# EAGLE design bb-8 (EAGLE 9.6.2)
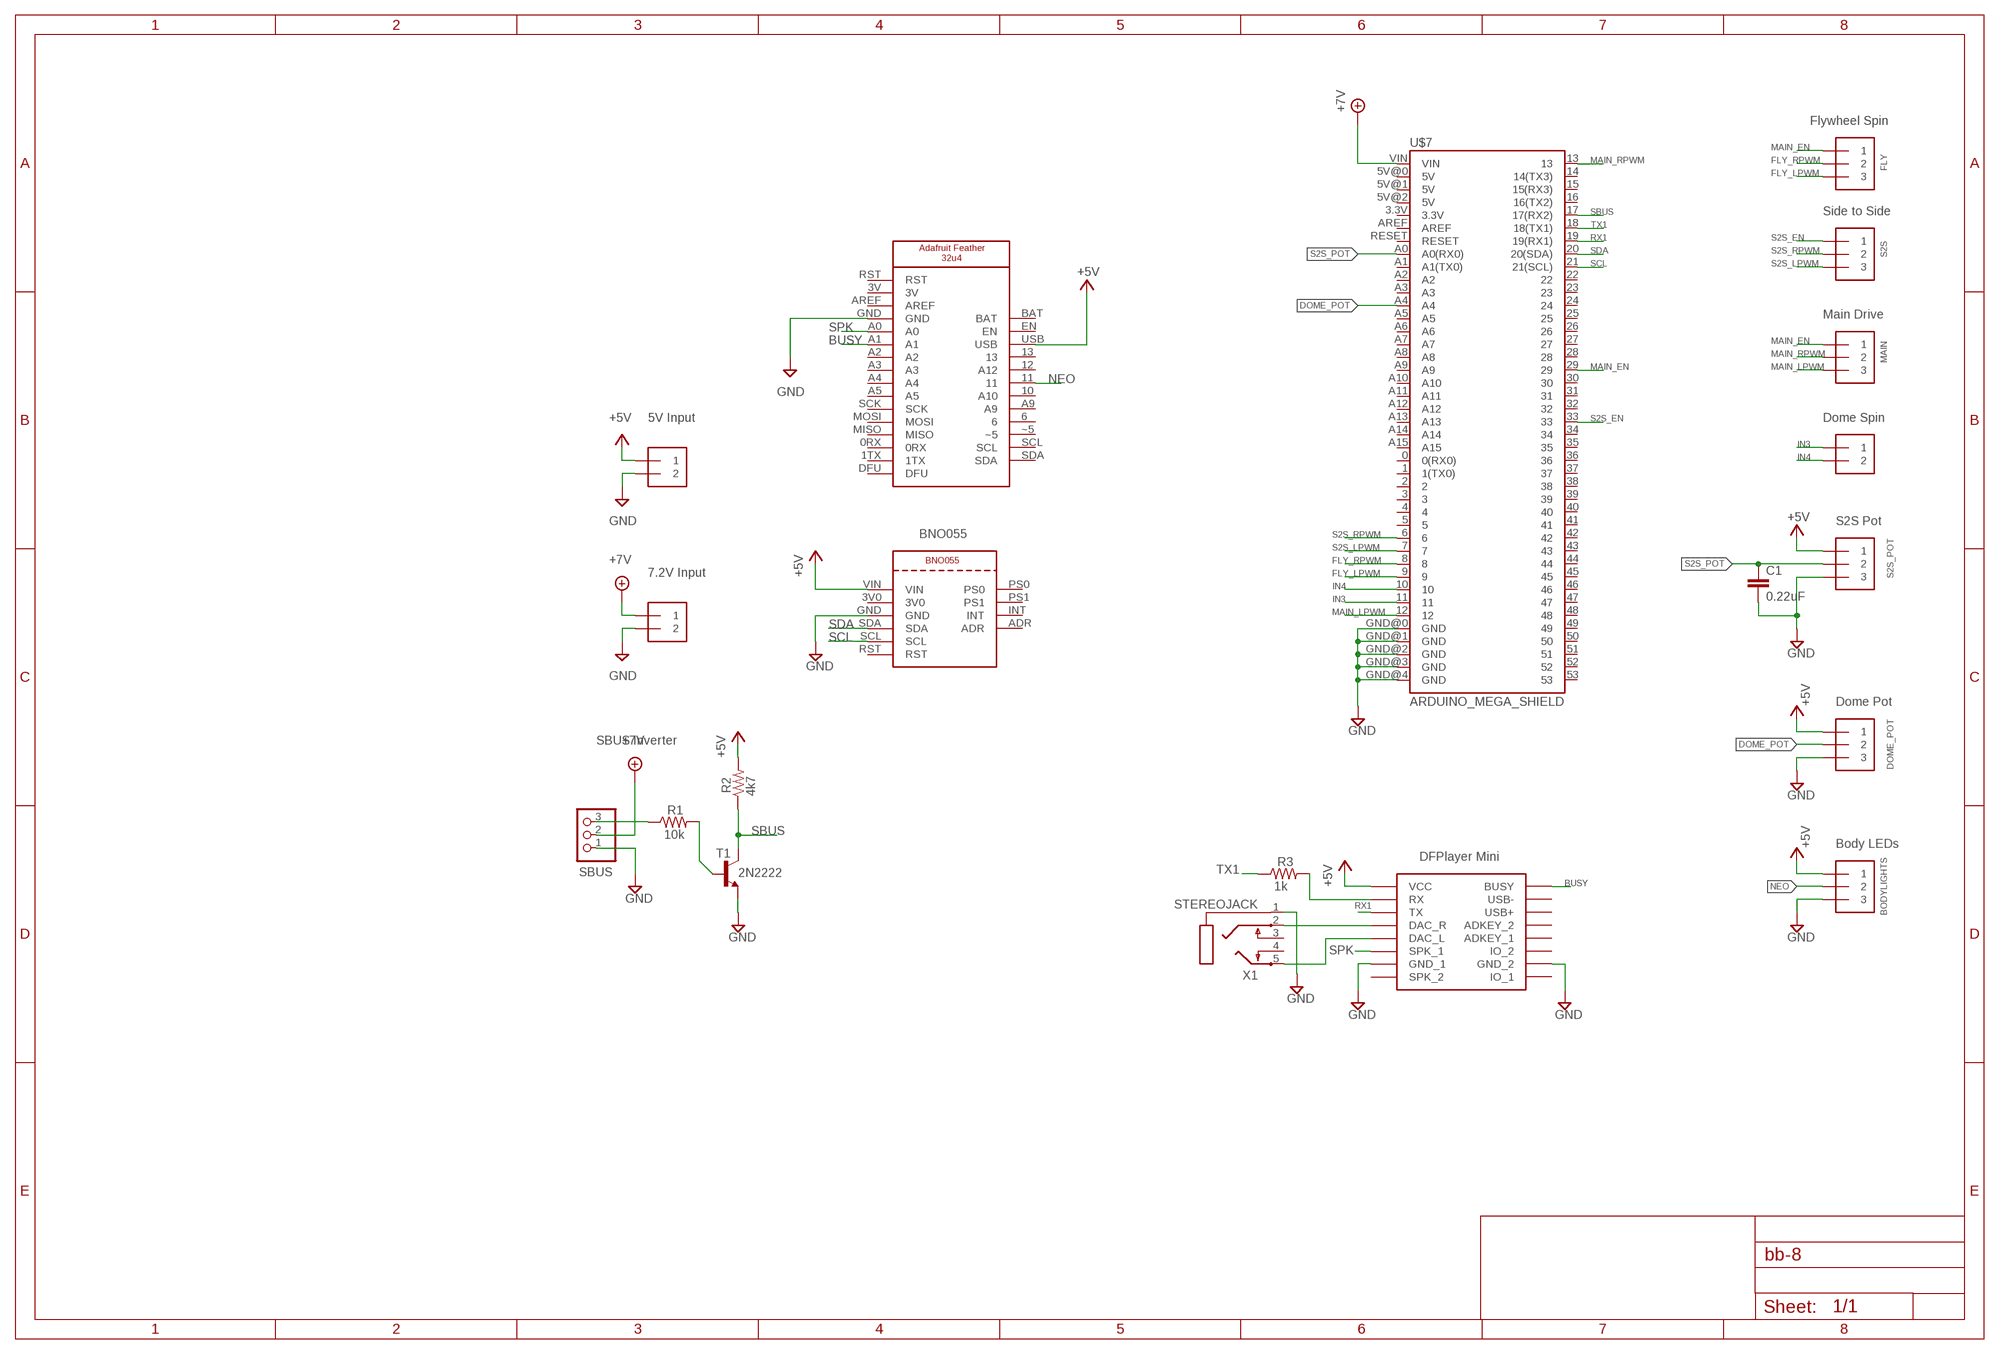
[diagram p0: schematic, sheet 1]

## Parts
5V  1X2-3.5MM  [1X2-3.5MM]
7V2  1X2-3.5MM  [1X2-3.5MM]
BODYLIGHTS  SCREW_TERMINAL_3_PIN  [SCREW_TERMINAL_3_PIN]
C1  0.22uF  C-EU050-024X044  [C050-024X044]
DOME  1X2-3.5MM  [1X2-3.5MM]
DOME_POT  SCREW_TERMINAL_3_PIN  [SCREW_TERMINAL_3_PIN]
FLY  SCREW_TERMINAL_3_PIN  [SCREW_TERMINAL_3_PIN]
MAIN  SCREW_TERMINAL_3_PIN  [SCREW_TERMINAL_3_PIN]
R1  10k  R-US_0204/7  [0204/7]
R2  4k7  R-US_0204/7  [0204/7]
R3  1k  R-US_0204/7  [0204/7]
S2S  SCREW_TERMINAL_3_PIN  [SCREW_TERMINAL_3_PIN]
S2S_POT  SCREW_TERMINAL_3_PIN  [SCREW_TERMINAL_3_PIN]
SBUS  PINHD-1X3  [1X03]
T1  2N2222  [TO92-EBC-OVAL]
U$1  DFPLAYER  [DFPLAYER]
U$2  ADAFRUIT_BNO055  [ADAFRUIT_BNO055]
U$3  ADAFRUIT_FEATHER_32U4  [ADAFRUIT_FEATHER_32U4]
U$7  ARDUINO_MEGA_SHIELD  [ARDUINO_MEGA_SHIELD]
X1  STEREOJACK  [STX3100]

## Nets
+5V: 5V.1 BODYLIGHTS.1 DOME_POT.1 R2.2 S2S_POT.1 U$1.VCC U$2.VIN U$3.USB
+7V: 7V2.1 SBUS.2 U$7.VIN
BUSY: U$1.BUSY U$3.A1
DAC_R: U$1.DAC_R X1.2
DOME_POT: DOME_POT.2 U$7.A4
FLY_LPWM: FLY.3 U$7.9
FLY_RPWM: FLY.2 U$7.8
GND: 5V.2 7V2.2 BODYLIGHTS.3 C1.2 DOME_POT.3 S2S_POT.3 SBUS.1 T1.E U$1.GND_1 U$1.GND_2 U$2.GND U$3.GND U$7.GND@0(GND) U$7.GND@1(GND) U$7.GND@2(GND) U$7.GND@3(GND) U$7.GND@4(GND) X1.1
IN3: DOME.1 U$7.11
IN4: DOME.2 U$7.10
MAIN_EN: FLY.1 MAIN.1 U$7.29
MAIN_LPWM: MAIN.3 U$7.12
MAIN_RPWM: MAIN.2 U$7.13
N$3: R1.2 T1.B
N$4: R3.2 U$1.RX
N$5: R1.1 SBUS.3
N$6: U$1.DAC_L X1.5
NEO: BODYLIGHTS.2 U$3.11
RX1: U$1.TX U$7.19(19(RX1))
S2S_EN: S2S.1 U$7.33
S2S_LPWM: S2S.3 U$7.7
S2S_POT: C1.1 S2S_POT.2 U$7.A0(A0(RX0))
S2S_RPWM: S2S.2 U$7.6
SBUS: R2.1 T1.C U$7.17(17(RX2))
SCL: U$2.SCL U$7.21(21(SCL))
SDA: U$2.SDA U$7.20(20(SDA))
SPK: U$1.SPK1(SPK_1) U$3.A0
TX1: R3.1 U$7.18(18(TX1))
Unconnected: U$1.ADKEY1(ADKEY_1) U$1.ADKEY2(ADKEY_2) U$1.IO1(IO_1) U$1.IO2(IO_2) U$1.SPK2(SPK_2) U$1.USB+ U$1.USB- U$2.3V0 U$2.ADR U$2.INT U$2.PS0 U$2.PS1 U$2.RST U$3.0RX U$3.1TX U$3.3V U$3.6 U$3.10(A10) U$3.12(A12) U$3.13 U$3.A2 U$3.A3 U$3.A4 U$3.A5 U$3.A9 U$3.AREF U$3.BAT U$3.DFU U$3.EN U$3.MISO U$3.MOSI U$3.RST U$3.SCK U$3.SCL U$3.SDA U$3.~5 U$7.0(0(RX0)) U$7.1(1(TX0)) U$7.2 U$7.3 U$7.3.3V U$7.4 U$7.5 U$7.5V@0(5V) U$7.5V@1(5V) U$7.5V@2(5V) U$7.14(14(TX3)) U$7.15(15(RX3)) U$7.16(16(TX2)) U$7.22 U$7.23 U$7.24 U$7.25 U$7.26 U$7.27 U$7.28 U$7.30 U$7.31 U$7.32 U$7.34 U$7.35 U$7.36 U$7.37 U$7.38 U$7.39 U$7.40 U$7.41 U$7.42 U$7.43 U$7.44 U$7.45 U$7.46 U$7.47 U$7.48 U$7.49 U$7.50 U$7.51 U$7.52 U$7.53 U$7.A1(A1(TX0)) U$7.A2 U$7.A3 U$7.A5 U$7.A6 U$7.A7 U$7.A8 U$7.A9 U$7.A10 U$7.A11 U$7.A12 U$7.A13 U$7.A14 U$7.A15 U$7.AREF U$7.RESET X1.3 X1.4

## Notes on the sheet
- Flywheel Spin
- Side to Side
- Main Drive
- 5V Input | Dome Spin
- S2S Pot
- BNO055
- 7.2V Input
- Dome Pot
- SBUS Inverter
- Body LEDs
- DFPlayer Mini

## Library data of the parts
5V 7V2 DOME = adafruit:1X2: 3.5mm Terminal block http://www.ladyada.net/library/pcb/eaglelibrary.html
BODYLIGHTS DOME_POT FLY MAIN S2S S2S_POT = BB8:SCREW_TERMINAL_3_PIN
C1 = rcl:C-EU: CAPACITOR, European symbol; SPICEPREFIX: C
R1-R3 = rcl:R-US_: RESISTOR, American symbol; SPICEPREFIX: R
SBUS = pinhead:PINHD-1X3: PIN HEADER
T1 = adafruit:2N2222: NPN TRANSISTOR Big oval pads
U$1 = DFPlayer_v1:DFPLAYER
U$2 = BB8:ADAFRUIT_BNO055
U$3 = BB8:ADAFRUIT_FEATHER_32U4
U$7 = BB8:ARDUINO_MEGA_SHIELD
X1 = adafruit:STEREOJACK: MIC/HEADPHONE JACK Stereo jack with two switches. Kycon STX3100, CUI SJ1-3555NG and/or 4UCon 05544

## Board
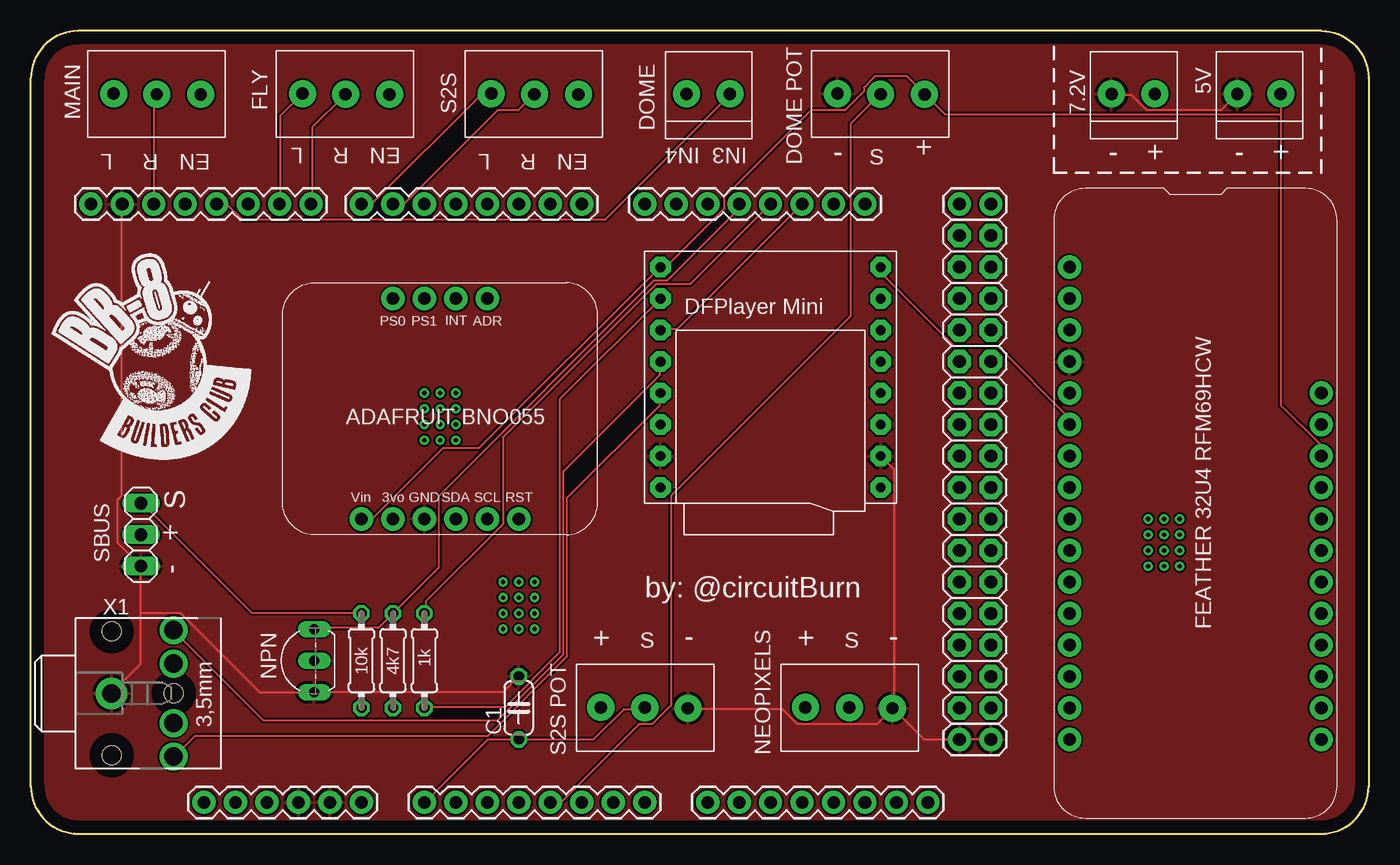
[diagram p1: board, top side]
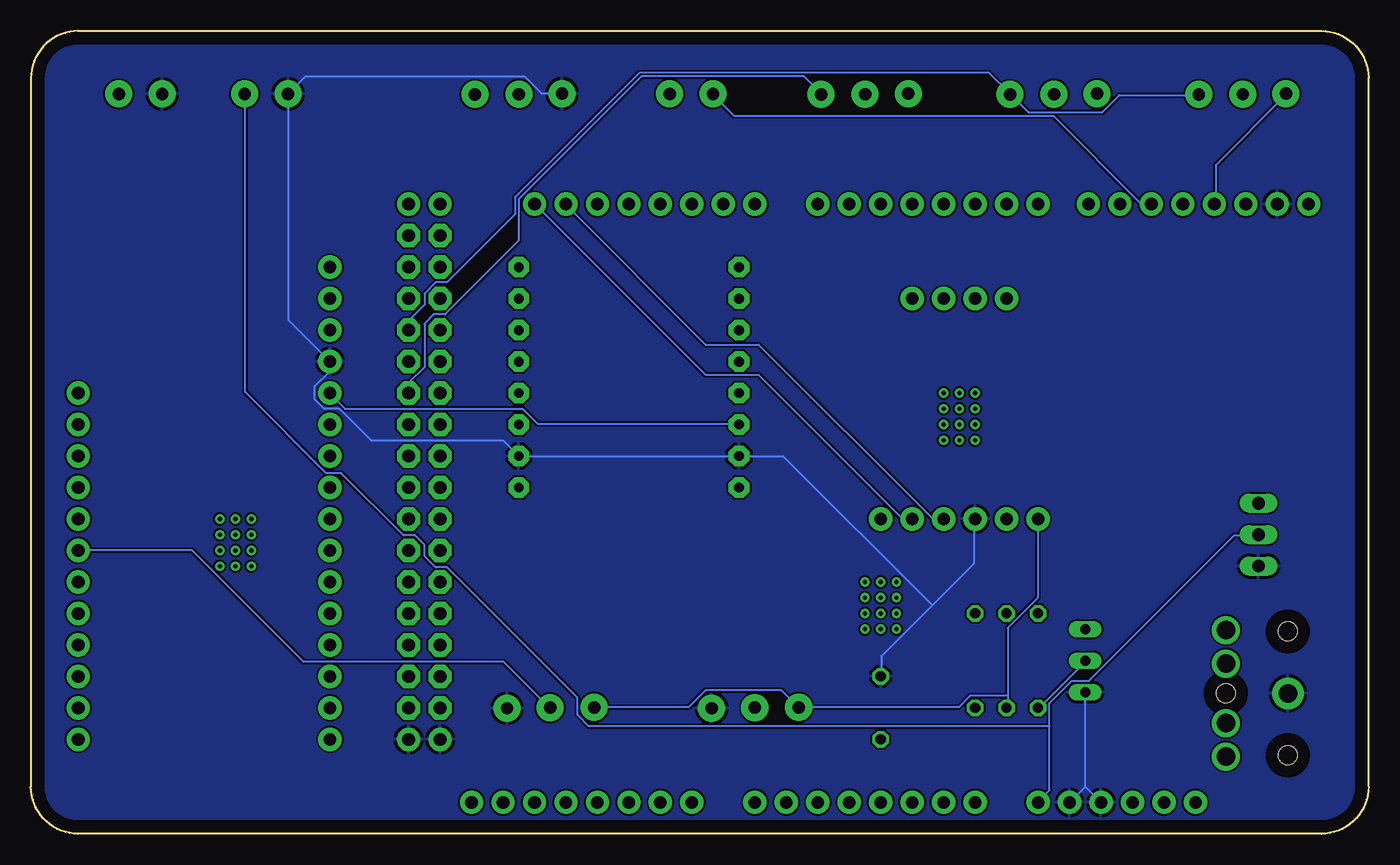
[diagram p2: board, bottom side, seen from below]

Size 107.95 x 64.77 mm. Coordinates in mm from the lower left corner, seen from the top.
Outline: 0,3.81 0,60.96 arc-90 3.81,64.77 104.14,64.77 arc-90 107.95,60.96 107.95,3.81 arc-90 104.14,0 3.81,0 arc-90 0,3.81
Copper layers (1*16): Top 0.035mm / dielectric 1.5mm / Bottom 0.035mm
Design rules "default": minimum track width 6mil, minimum drill 0.35mm, track to track 6mil, track to pad 6mil, pad to pad 6mil, via to via 6mil, smd to smd 6mil, copper to edge 40mil, drill to drill 6mil, minimum pad ring 10mil, minimum via ring 8mil, stop-mask expansion 4mil, vias tented up to drill 0mil, thermal gap 10mil

### Footprints (pad centres in the part's own frame; a part is rotated, then mirrored left to right if it is on the bottom)
1X2-3.5MM = drill 1 pad 2.184: 1 1.8,0; 2 -1.7,0
SCREW_TERMINAL_3_PIN = drill 1 pad 2.184: 1 -3.54,0.04; 2 0.01,0.02; 3 3.49,-0.03
C050-024X044 = drill 0.813 octagon: 1 -2.54,0; 2 2.54,0
0204/7 = drill 0.813 octagon: 1 -3.81,0; 2 3.81,0
1X03 = drill 1.016 long: 1 -2.54,0; 2 0,0; 3 2.54,0
TO92-EBC-OVAL = drill 0.813 long: B 0,-1.27; C 2.54,-1.27; E -2.54,-1.27
DFPLAYER = drill 0.8 pad 1.676 octagon: ADKEY1 8.89,-1.27; ADKEY2 8.89,1.27; BUSY 8.89,8.89; DAC_L -8.89,-1.27; DAC_R -8.89,1.27; GND_1 -8.89,-6.35; GND_2 8.89,-6.35; IO1 8.89,-8.89; IO2 8.89,-3.81; RX -8.89,6.35; SPK1 -8.89,-3.81; SPK2 -8.89,-8.89; TX -8.89,3.81; USB+ 8.89,3.81; USB- 8.89,6.35; VCC -8.89,8.89
ADAFRUIT_BNO055 = drill 1.016 pad 1.88: 3V0 8.89,1.27; ADR 16.51,19.05; GND 11.43,1.27; INT 13.97,19.05; PS0 8.89,19.05; PS1 11.43,19.05; RST 19.05,1.27; SCL 16.51,1.27; SDA 13.97,1.27; VIN 6.35,1.27
ADAFRUIT_FEATHER_32U4 = drill 1.016 pad 1.88: 0RX 39.37,1.27; 1TX 41.91,1.27; 3V 8.89,1.27; 6 36.83,21.59; 10 31.75,21.59; 11 29.21,21.59; 12 26.67,21.59; 13 24.13,21.59; A0 16.51,1.27; A1 19.05,1.27; A2 21.59,1.27; A3 24.13,1.27; A4 26.67,1.27; A5 29.21,1.27; A9 34.29,21.59; AREF 11.43,1.27; BAT 16.51,21.59; DFU 44.45,1.27; EN 19.05,21.59; GND 13.97,1.27; MISO 36.83,1.27; MOSI 34.29,1.27; RST 6.35,1.27; SCK 31.75,1.27; SCL 41.91,21.59; SDA 44.45,21.59; USB 21.59,21.59; ~5 39.37,21.59
ARDUINO_MEGA_SHIELD = drill 1.016 pad 1.88: 0 13.97,24.13; 1 11.43,24.13; 2 8.89,24.13; 3 6.35,24.13; 3.3V -13.97,-24.13; 4 3.81,24.13; 5 1.27,24.13; 5V@0 -11.43,-24.13; 5V@1 44.45,24.13; 5V@2 46.99,24.13; 6 -1.27,24.13; 7 -3.81,24.13; 8 -7.874,24.13; 9 -10.414,24.13; 10 -12.954,24.13; 11 -15.494,24.13; 12 -18.034,24.13; 13 -20.574,24.13; 14 19.05,24.13; 15 21.59,24.13; 16 24.13,24.13; 17 26.67,24.13; 18 29.21,24.13; 19 31.75,24.13; 20 34.29,24.13; 21 36.83,24.13; A0 1.27,-24.13; A1 3.81,-24.13; A2 6.35,-24.13; A3 8.89,-24.13; A4 11.43,-24.13; A5 13.97,-24.13; A6 16.51,-24.13; A7 19.05,-24.13; A8 24.13,-24.13; A9 26.67,-24.13; A10 29.21,-24.13; A11 31.75,-24.13; A12 34.29,-24.13; A13 36.83,-24.13; A14 39.37,-24.13; A15 41.91,-24.13; AREF -25.654,24.13; GND@0 -8.89,-24.13; GND@1 -6.35,-24.13; GND@2 44.45,-19.05; GND@3 46.99,-19.05; GND@4 -23.114,24.13; RESET -16.51,-24.13; VIN -3.81,-24.13 | drill 1.016 pad 1.88 octagon: 22 44.45,21.59; 23 46.99,21.59; 24 44.45,19.05; 25 46.99,19.05; 26 44.45,16.51; 27 46.99,16.51; 28 44.45,13.97; 29 46.99,13.97; 30 44.45,11.43; 31 46.99,11.43; 32 44.45,8.89; 33 46.99,8.89; 34 44.45,6.35; 35 46.99,6.35; 36 44.45,3.81; 37 46.99,3.81; 38 44.45,1.27; 39 46.99,1.27; 40 44.45,-1.27; 41 46.99,-1.27; 42 44.45,-3.81; 43 46.99,-3.81; 44 44.45,-6.35; 45 46.99,-6.35; 46 44.45,-8.89; 47 46.99,-8.89; 48 44.45,-11.43; 49 46.99,-11.43; 50 44.45,-13.97; 51 46.99,-13.97; 52 44.45,-16.51; 53 46.99,-16.51
STX3100 = drill 1.5 pad 2.54: 1 2.7,-0.1 | drill 1.5: 2 7.7,5; 3 7.7,2.3; 4 7.7,-2.5; 5 7.7,-5.2 | hole 1.5: 2.7,4.9; 2.7,-5.1; 7.7,-0.1

### Placement (x,y rotation side)
5V  99.06,59.69 0 top
7V2  88.9,59.69 0 top
BODYLIGHTS  66.04,10.16 0 top
C1  39.37,10.16 90 top
DOME  54.61,59.69 0 top
DOME_POT  68.58,59.69 180 top
FLY  25.4,59.69 180 top
MAIN  10.16,59.69 180 top
R1  26.67,13.97 270 top
R2  29.21,13.97 270 top
R3  31.75,13.97 270 top
S2S  40.64,59.69 180 top
S2S_POT  49.53,10.16 0 top
SBUS  8.89,24.13 90 top
T1  21.59,13.97 90 top
U$1  59.69,36.83 0 top
U$2  20.32,24.13 0 top
U$3  82.55,52.07 270 top
U$7  30.48,26.67 0 top
X1  3.81,11.43 0 top

### Tracks (layer width: path | path; a pad name or v marks a point on that pad's centre or on a via)
+5V
  Top 0.152: 100.89,58.06 100.89,59.59 5V.1 | 100.89,58.06 100.89,34.59 104.09,31.39 104.09,30.48 U$3.USB | 100.89,58.06 73.76,58.06 72.24,59.59 DOME_POT.1 72.08,59.74 70.71,61.11 68.12,61.11 67.21,60.2 67.21,59.89 65.68,58.37 62.94,58.37 55.93,51.36 55.93,50.44 51.21,45.72 U$1.VCC 50.75,45.72 36.12,31.09 33.22,31.09 27.58,25.45 26.67,25.45 U$2.VIN
  Bottom 0.152: 29.11,11.12 29.11,16.61 26.67,19.05 U$2.VIN | 29.11,11.12 29.11,10.21 R2.2 | 29.11,11.12 32.16,11.12 33.07,10.21 45.87,10.21 S2S_POT.1 46.02,10.21 47.4,11.58 53.49,11.58 54.86,10.21 62.48,10.21 BODYLIGHTS.1
+7V
  Bottom 0.152: 25.76,8.69 25.76,3.5 26.67,2.59 U$7.VIN | 25.76,8.69 25.76,10.52 23.93,12.34 22.55,12.34 10.82,24.08 8.99,24.08 SBUS.2 | 25.76,8.69 62.94,8.69 63.86,9.6 63.86,10.97 74.37,21.49 75.29,21.49 76.2,22.4 76.2,23.32 76.96,24.08 77.88,24.08 82.91,29.11 84.12,29.11 90.68,35.66 90.68,59.59 7V2.1
BUSY
  Top 0.152: U$1.BUSY 68.58,45.26 74.52,39.32 78.03,39.32 83.82,33.53 U$3.A1
DAC_R
  Top 0.152: U$1.DAC_R 50.75,38.1 50.75,37.03 42.98,29.26 42.98,14.48 37.64,9.14 18.75,9.14 11.58,16.31 X1.2
DOME_POT
  Top 0.152: U$7.A4 41.91,2.59 42.82,2.59 49.07,8.84 50.14,8.84 51.66,10.36 51.66,27.28 66.14,41.76 66.14,57.3 68.43,59.59 DOME_POT.2
FLY_LPWM
  Top 0.152: U$7.9 20.12,50.9 20.12,57.91 21.79,59.59 FLY.3
FLY_RPWM
  Top 0.152: U$7.8 22.71,50.9 22.71,57 25.3,59.59 FLY.2
GND
  Top 0.152: C1.2 38.1,11.43 T1.E 18.44,11.43 12.04,17.83 8.84,17.83 | 8.84,17.83 8.84,13.72 6.55,11.43 X1.1 | 8.84,17.83 8.84,21.49 SBUS.1 7.01,23.47 7.01,26.98 7.32,27.28 7.32,50.75 U$7.GND@4 | 7V2.2 87.33,59.59 88.85,59.59 90.07,58.37 96.01,58.37 97.23,59.59 5V.2 | U$7.GND@3 U$7.GND@2 72.08,7.62 69.65,10.06 BODYLIGHTS.3 | S2S_POT.3 53.03,10.06 60.66,10.06 61.87,8.84 68.28,8.84 69.49,10.06 BODYLIGHTS.3 | U$1.GND_2 69.65,29.41 69.65,10.21 BODYLIGHTS.3
  Bottom 0.152: 22.86,3.81 T1.E | U$7.GND@0 22.86,3.81 | 22.86,3.81 U$7.GND@1 | 35.2,18.44 31.85,21.79 31.85,25.3 U$2.GND | 35.2,18.44 39.32,14.33 39.32,12.8 C1.2 | DOME_POT.3 65.23,59.74 66.75,59.74 68.12,61.11 85.8,61.11 87.17,59.74 7V2.2 87.17,59.59 87.17,41.45 U$3.GND 83.82,37.34 85.04,36.12 85.04,35.05 84.28,34.29 83.06,34.29 80.47,31.7 69.8,31.7 U$1.GND_2 U$1.GND_1 47.24,30.48 35.2,18.44
  pour Top: 0,64.77 107.95,64.77 107.95,0 0,0
  pour Bottom: 0,64.77 107.95,64.77 107.95,0 0,0
IN3
  Top 0.152: U$7.11 15.09,50.75 15.85,50.75 17.07,49.53 46.33,49.53 56.39,59.59 DOME.1
IN4
  Bottom 0.152: U$7.10 17.53,50.9 18.44,50.9 25.45,57.91 51.21,57.91 52.88,59.59 DOME.2
MAIN_EN
  Bottom 0.152: U$7.29 77.42,40.69 77.42,41.45 76.2,42.67 76.2,43.59 75.29,44.5 74.37,44.5 68.89,49.99 68.89,51.36 58.83,61.42 30.63,61.42 28.96,59.74 FLY.1 28.8,59.59 27.43,58.22 21.49,58.22 20.12,59.59 13.72,59.59 MAIN.1
MAIN_LPWM
  Bottom 0.152: U$7.12 12.34,50.9 12.34,53.95 6.71,59.59 MAIN.3
MAIN_RPWM
  Top 0.152: U$7.13 9.91,59.44 10.06,59.59 MAIN.2
N$1  (via drill 0.35)
  other vias: 90.17,25.4
N$2  (via drill 0.35)
  other vias: 91.44,25.4
N$3
  Bottom 0.152: T1.B 22.86,13.87 26.67,10.06 R1.2
N$4
  Top 0.152: U$1.RX 42.67,35.05 42.67,14.63 38.25,10.21 31.85,10.21 R3.2
N$5
  Top 0.152: R1.1 26.67,17.83 17.83,17.83 8.99,26.67 SBUS.3
N$6
  Top 0.152: U$1.DAC_L 50.75,35.51 50.75,34.59 43.28,27.13 43.28,14.33 36.88,7.92 13.26,7.92 11.58,6.25 X1.5
N$7  (via drill 0.35)
  other vias: 92.71,25.4
N$8  (via drill 0.35)
  other vias: 92.71,24.13
N$9  (via drill 0.35)
  other vias: 91.44,24.13
N$10  (via drill 0.35)
  other vias: 90.17,24.13
N$11  (via drill 0.35)
  other vias: 90.17,22.86
N$12  (via drill 0.35)
  other vias: 91.44,22.86
N$13  (via drill 0.35)
  other vias: 92.71,22.86
N$14  (via drill 0.35)
  other vias: 92.71,21.59
N$15  (via drill 0.35)
  other vias: 91.44,21.59
N$16  (via drill 0.35)
  other vias: 90.17,21.59
N$17  (via drill 0.35)
  other vias: 31.75,35.56
N$18  (via drill 0.35)
  other vias: 33.02,35.56
N$19  (via drill 0.35)
  other vias: 34.29,35.56
N$20  (via drill 0.35)
  other vias: 34.29,34.29
N$21  (via drill 0.35)
  other vias: 33.02,34.29
N$22  (via drill 0.35)
  other vias: 31.75,34.29
N$23  (via drill 0.35)
  other vias: 31.75,33.02
N$24  (via drill 0.35)
  other vias: 33.02,33.02
N$25  (via drill 0.35)
  other vias: 34.29,33.02
N$26  (via drill 0.35)
  other vias: 34.29,31.75
N$27  (via drill 0.35)
  other vias: 33.02,31.75
N$28  (via drill 0.35)
  other vias: 31.75,31.75
N$29  (via drill 0.35)
  other vias: 38.1,20.32
N$30  (via drill 0.35)
  other vias: 39.37,20.32
N$31  (via drill 0.35)
  other vias: 40.64,20.32
N$32  (via drill 0.35)
  other vias: 40.64,19.05
N$33  (via drill 0.35)
  other vias: 39.37,19.05
N$34  (via drill 0.35)
  other vias: 38.1,19.05
N$35  (via drill 0.35)
  other vias: 38.1,17.78
N$36  (via drill 0.35)
  other vias: 39.37,17.78
N$37  (via drill 0.35)
  other vias: 40.64,17.78
N$38  (via drill 0.35)
  other vias: 40.64,16.51
N$39  (via drill 0.35)
  other vias: 39.37,16.51
N$40  (via drill 0.35)
  other vias: 38.1,16.51
NEO
  Bottom 0.152: U$3.11 94.94,22.86 85.95,13.87 69.8,13.87 66.14,10.21 BODYLIGHTS.2
RX1
  Top 0.152: U$7.19 52.12,40.69 50.9,40.69 U$1.TX
S2S_EN
  Bottom 0.152: U$7.33 77.42,35.66 77.42,36.42 76.2,37.64 76.2,41.15 75.44,41.91 74.52,41.91 68.58,47.85 68.58,51.21 58.67,61.11 45.57,61.11 44.2,59.74 S2S.1
S2S_LPWM
  Top 0.152: U$7.7 26.67,50.9 27.58,50.9 36.27,59.59 37.03,59.59 S2S.3
S2S_POT
  Top 0.152: U$7.A0 31.85,2.59 36.88,7.62 C1.1 45.41,7.62 47.85,10.06 49.53,10.06 S2S_POT.2
S2S_RPWM
  Top 0.152: U$7.6 29.26,50.9 30.18,50.9 37.64,58.37 39.32,58.37 40.54,59.59 S2S.2
SBUS
  Top 0.152: T1.C 22.86,16.61 28.04,16.61 R2.1 32.92,21.49 32.92,27.28 50.29,44.65 51.36,44.65 57.15,50.44 U$7.17
SCL
  Bottom 0.152: U$2.SCL 36.88,25.45 37.64,25.45 49.23,37.03 53.49,37.03 67.21,50.75 U$7.21
SDA
  Bottom 0.152: U$2.SDA 34.29,25.45 35.2,25.45 49.23,39.47 53.49,39.47 64.77,50.75 U$7.20
SPK
  Bottom 0.152: U$1.SPK1 50.9,33.07 67.06,33.07 68.28,34.29 82.6,34.29 83.82,35.51 U$3.A0
TX1
  Top 0.152: R3.1 31.85,17.83 31.85,18.75 38.1,24.99 38.1,32 50.44,44.35 53.19,44.35 59.59,50.75 U$7.18

### Text on the board
tPlace: DOME POT | - | + | - | + | - | + | L | R | EN | L | R | EN | L | R | EN | IN4 | IN3 | S | S | + | - | by: @circuitBurn | + | S | - | + | S | - | 10k | 4k7 | 1k | NPN | S2S POT
tNames: 5V | 7.2V | ADAFRUIT BNO055 | FEATHER 32U4 RFM69HCW | NEOPIXELS